# Altium schematic sheet ThrowBot_TX_Main_Board.SchDoc
size 247 x 208 mm; SheetNumber: 1; SheetTotal: 1
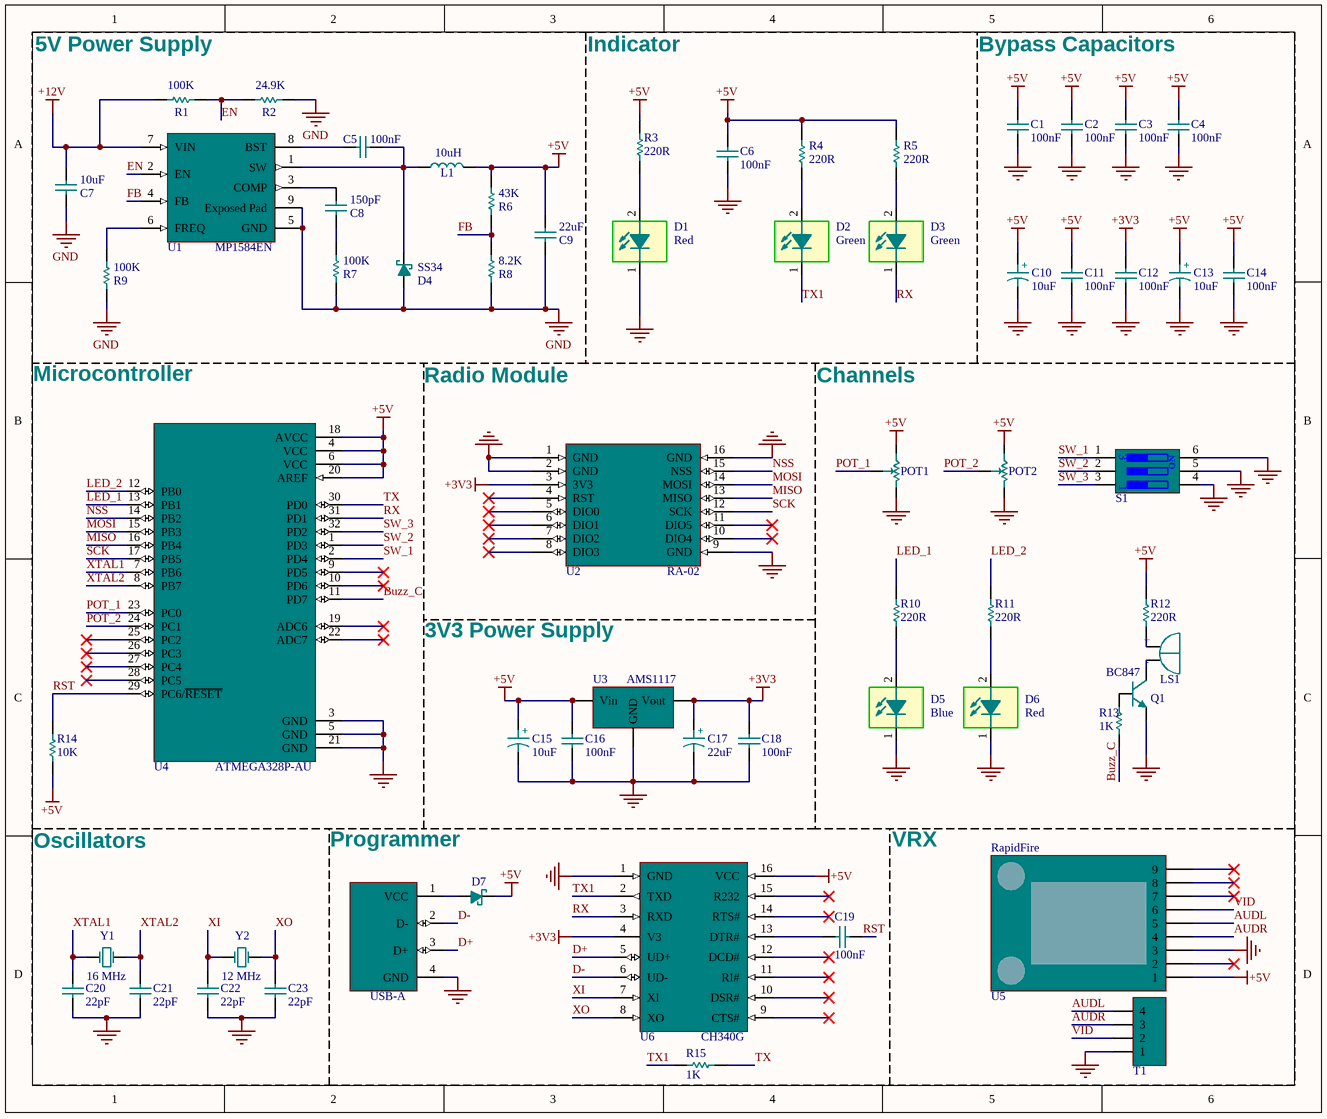
[diagram p0: ThrowBot_TX_Main_Board.SchDoc]

## Parts
C1  Val-1: 100nF  [CAP 1206]  (hidden comment: Cap)
C2  Val-1: 100nF  [CAP 1206]  (hidden comment: Cap)
C3  Val-1: 100nF  [CAP 1206]  (hidden comment: Cap)
C4  Val-1: 100nF  [CAP 1206]  (hidden comment: Cap)
C5  Val-1: 100nF  [CAP 1206]  (hidden comment: Cap)
C6  Val-1: 100nF  [CAP 1206]  (hidden comment: Cap)
C7  Val-4: 10uF  [CAP 1206]  (hidden comment: Cap)
C8  Val-5: 150pF  [CAP 1206]  (hidden comment: Cap)
C9  Val-3: 22uF  [CAP 1206]  (hidden comment: Cap)
C10  Val-1: 10uF  [CAP Tantalum Size B]  (hidden comment: Cap BiPolar)
C11  Val-1: 100nF  [CAP 1206]  (hidden comment: Cap)
C12  Val-1: 100nF  [CAP 1206]  (hidden comment: Cap)
C13  Val-1: 10uF  [CAP Tantalum Size B]  (hidden comment: Cap BiPolar)
C14  Val-1: 100nF  [CAP 1206]  (hidden comment: Cap)
C15  Val-1: 10uF  [CAP Tantalum Size B]  (hidden comment: Cap BiPolar)
C16  Val-1: 100nF  [CAP 1206]  (hidden comment: Cap)
C17  Val-1: 22uF  [CAP Tantalum Size B]  (hidden comment: Cap BiPolar)
C18  Val-1: 100nF  [CAP 1206]  (hidden comment: Cap)
C19  Val-1: 100nF  [CAP 1206]  (hidden comment: Cap)
C20  Val-2: 22pF  [CAP 1206]  (hidden comment: Cap)
C21  Val-2: 22pF  [CAP 1206]  (hidden comment: Cap)
C22  Val-2: 22pF  [CAP 1206]  (hidden comment: Cap)
C23  Val-2: 22pF  [CAP 1206]  (hidden comment: Cap)
D1  Color-2: Red  [LED 1206]  (hidden comment: LED)
D2  Color-3: Green  [LED 1206]  (hidden comment: LED)
D3  Color-3: Green  [LED 1206]  (hidden comment: LED)
D4  SS34  [SS34]
D5  Color-1: Blue  [LED 1206]  (hidden comment: LED)
D6  Color-2: Red  [LED 1206]  (hidden comment: LED)
D7  SS34  [SS34]  (value not drawn)
L1  value 10uH  [IND 10uH]  (hidden comment: Inductor)
LS1  Buzzer-5V  [Buzzer-5V]  (value not drawn)
POT1  Pot  [Pot]  (value not drawn)
POT2  Pot  [Pot]  (value not drawn)
Q1  BC847  [BC847-SOT23]
R1  Val-4: 100K  [RES 1206]  (hidden comment: Resistor)
R2  Val-5: 24.9K  [RES 1206]  (hidden comment: Resistor)
R3  Val-3: 220R  [RES 1206]  (hidden comment: Resistor)
R4  Val-3: 220R  [RES 1206]  (hidden comment: Resistor)
R5  Val-3: 220R  [RES 1206]  (hidden comment: Resistor)
R6  Val-7: 43K  [RES 1206]  (hidden comment: Resistor)
R7  Val-4: 100K  [RES 1206]  (hidden comment: Resistor)
R8  Val-6: 8.2K  [RES 1206]  (hidden comment: Resistor)
R9  Val-4: 100K  [RES 1206]  (hidden comment: Resistor)
R10  Val-3: 220R  [RES 1206]  (hidden comment: Resistor)
R11  Val-3: 220R  [RES 1206]  (hidden comment: Resistor)
R12  Val-3: 220R  [RES 1206]  (hidden comment: Resistor)
R13  Val-1: 1K  [RES 1206]  (hidden comment: Resistor)
R14  Val-2: 10K  [RES 1206]  (hidden comment: Resistor)
R15  Val-1: 1K  [RES 1206]  (hidden comment: Resistor)
S1  DIP Switch x3  [DIP Switch x3]  (value not drawn)
T1  4 Pin Socket  [XH-4AW]  (value not drawn)
U1  MP1584EN  [MP1584EN]
U2  RA-02  [RA-02]
U3  AMS1117  [AMS1117]
U4  ATMEGA328P-AU  [ATmega328]
U5  RapidFire  [RapidFire]
U6  CH340G  [CH340G]
USB1  USB-A  [USB-A-SMD]
Y1  Val-2: 16 MHz  [Crystal-5032]  (hidden comment: XTAL)
Y2  Val-1: 12 MHz  [Crystal-5032]  (hidden comment: XTAL)

## Blocks framed on the sheet
5V Power Supply: C5 C7-C9 D4 L1 R1 R2 R6-R9 U1

## Nets
+3V3: C12.1 C17.1 C18.1 U2.3(3V3) U3.2(Vout) U6.4(V3)
+5V: C1.1 C2.1 C3.1 C4.1 C6.1 C9.2 C10.1 C11.1 C13.1 C14.1 C15.1 C16.1 D7.2(K) L1.2 POT1.1(CCW) POT2.1(CCW) R3.2 R4.1 R5.1 R6.2 R12.2 R14.2 U3.3(Vin) U4.4(VCC) U4.6(VCC) U4.18(AVCC) U4.20(AREF) U5.1 U6.16(VCC)
+12V: C7.2 R1.2 U1.7(VIN)
GND: C1.2 C2.2 C3.2 C4.2 C6.2 C7.1 C9.1 C10.2 C11.2 C12.2 C13.2 C14.2 C15.2 C16.2 C17.2 C18.2 C20.1 C21.1 C22.1 C23.1 D1.1 D4.1(A) D5.1 D6.1 POT1.2(CW) POT2.2(CW) Q1.2(E) R2.2 R7.1 R8.1 R9.1 S1.4 S1.5 S1.6 T1.1 U1.5(GND) U1.9(Exposed_Pad) U2.1(GND) U2.2(GND) U2.9(GND) U2.16(GND) U3.1(GND) U4.3(GND) U4.5(GND) U4.21(GND) U5.3 U6.1(GND) USB1.4(GND)
AUDL: T1.4 U5.5
AUDR: T1.3 U5.4
Buzz_C: R13.1 U4.11(PD7)
D+: U6.5(UD+) USB1.3(D+)
D-: U6.6(UD-) USB1.2(D-)
EN: R1.1 R2.1 U1.2(EN)
FB: R6.1 R8.2 U1.4(FB)
LED_1: R10.2 U4.13(PB1)
LED_2: R11.2 U4.12(PB0)
MISO: U2.13(MISO) U4.16(PB4)
MOSI: U2.14(MOSI) U4.15(PB3)
NSS: U2.15(NSS) U4.14(PB2)
POT_1: POT1.3(SetPoint) U4.23(PC0)
POT_2: POT2.3(SetPoint) U4.24(PC1)
RST: C19.1 R14.1 U4.29(PC6/~{RESET})
RX: D3.1 U4.31(PD1) U6.3(RXD)
SCK: U2.12(SCK) U4.17(PB5)
SW_1: S1.1 U4.2(PD4)
SW_2: S1.2 U4.1(PD3)
SW_3: S1.3 U4.32(PD2)
TX: R15.2 U4.30(PD0)
TX1: D2.1 R15.1 U6.2(TXD)
VID: T1.2 U5.6
XI: C22.2 U6.7(XI) Y2.1(OSC1)
XO: C23.2 U6.8(XO) Y2.2(OSC2)
XTAL1: C20.2 U4.7(PB6) Y1.1(OSC1)
XTAL2: C21.2 U4.8(PB7) Y1.2(OSC2)
NetC5_1: C5.1 D4.2(K) L1.1 U1.1(SW)
NetC5_2: C5.2 U1.8(BST)
NetC8_1: C8.1 R7.2
NetC8_2: C8.2 U1.3(COMP)
NetC19_2: C19.2 U6.13(DTR#)
NetD1_2: D1.2 R3.1
NetD2_2: D2.2 R4.2
NetD3_2: D3.2 R5.2
NetD5_2: D5.2 R10.1
NetD6_2: D6.2 R11.1
NetD7_1: D7.1(A) USB1.1(VCC)
NetLS1_N: LS1.N(NEG) Q1.3(C)
NetLS1_P: LS1.P(POS) R12.1
NetQ1_1: Q1.1(B) R13.2
NetR9_2: R9.2 U1.6(FREQ)

Not connected (* = marked no-connect by the designer): U2 4(RST)* 5(DIO0)* 6(DIO1)* 7(DIO2)* 8(DIO3)* 10(DIO4)* 11(DIO5)*; U4 9(PD5)* 10(PD6)* 19(ADC6)* 22(ADC7)* 25(PC2)* 26(PC3)* 27(PC4)* 28(PC5)*; U5 2* 7* 8* 9*; U6 9(CTS#)* 10(DSR#)* 11(RI#)* 12(DCD#)* 14(RTS#)* 15(R232)*

## Notes on the sheet
- Indicator
- Bypass Capacitors
- Microcontroller
- Radio Module
- Channels
- 3V3 Power Supply
- Oscillators
- Programmer
- VRX
- (in symbol Buzzer-5V) +; -
- (in symbol Cap BiPolar) +
- (in symbol DIP Switch x3) ON

## Library data of the parts
C1 = Cap: AVCC Cap; Val-2: 22pF; Val-3: 22uF
C2 C3 = Cap: VCC Cap; Val-2: 22pF; Val-3: 22uF
C4 = Cap: AREF Cap; Val-2: 22pF; Val-3: 22uF
C5 = Cap: 1206 Capacitor; Val-2: 22pF; Val-3: 22uF; Val-4: 10uF50V
C6 C11 C12 = Cap: USB to TTL Cap; Val-2: 22pF; Val-3: 22uF
C7 = Cap: 1206 Capacitor; Val-1: 100nF; Val-2: 22pF; Val-3: 22uF; Val-5: 150pF
C8 = Cap: 1206 Capacitor; Val-1: 100nF; Val-2: 22pF; Val-3: 22uF; Val-4: 10uF
C9 = Cap: 1206 Capacitor; Val-1: 100nF; Val-2: 22pF; Val-4: 10uF; Val-5: 150pF
C10 = Cap BiPolar: USB to TTL Cap; Val-2: 100uF; Val-3: 1000uF
C13 = Cap BiPolar: RapidFire Cap; Val-2: 100uF; Val-3: 1000uF
C14 = Cap: RapidFire Cap; Val-2: 22pF; Val-3: 22uF
C15 C17 = Cap BiPolar: 3.3V Regulator Cap; Val-2: 100uF; Val-3: 1000uF
C16 C18 = Cap: 3.3V Regulator Cap; Val-2: 22pF; Val-3: 22uF
C19 = Cap: Programmer Cap; Val-2: 22pF; Val-3: 22uF
C20-C23 = Cap: 1206 Capacitor; Val-1: 100nF; Val-3: 22uF
D1 D6 = LED: Color-1: Blue; Color-3: Green; Color-4: White
D2 D3 = LED: Color-1: Blue; Color-2: Red; Color-4: White
D4 = SS34: Diode Schottky 40 V 3A Surface Mount SMA; MF: MDD; SnapEDA_Link: https://www.snapeda.com/parts/SS34/MDD/view-part/?ref=snap; Package: None; Value: *; MP: SS34; Check_prices: https://www.snapeda.com/parts/SS34/MDD/view-part/?ref=eda
D5 = LED: Color-2: Red; Color-3: Green; Color-4: White
D7 = SS34: Diode Schottky 40 V 3A Surface Mount SMA
L1 = Inductor: Code_IEC: 1005; Published: 8-Jun-2000; LatestRevisionDate: 29-May-2009; LatestRevisionNote: IPC-7351 Footprint Added.; PackageReference: 0402-A; Publisher: Altium Limited; PackageDescription: Chip Inductor; Code_JEITA: 0402
Q1 = BC847: NPN General-purpose Transistor; Designer: Abbas Basereh; Desc.: Plastic Medium-Power. Silicon NPN Transistors; Data: 27-12-2016
R1 R7 R9 = Resistor: Val-1: 1K; Val-2: 10K; Val-3: 220R; Val-5: 24.9K; Val-6: 8.2K; Val-7: 43K
R2 = Resistor: Val-1: 1K; Val-2: 10K; Val-3: 220R; Val-4: 100K; Val-6: 8.2K; Val-7: 43K
R3 R10 R11 = Resistor: Val-1: 1K; Val-2: 10K
R4 R5 R12 = Resistor: Val-1: 1K; Val-2: 10K; Val-4: 100K; Val-5: 24.9K; Val-6: 8.2K; Val-7: 43K; Val-8: 150R; Val-9: 100m; Val-10: 6K; Val-11: 4K; Val-12: 1.2K
R6 = Resistor: Val-1: 1K; Val-2: 10K; Val-3: 220R; Val-4: 100K; Val-5: 24.9K; Val-6: 8.2K
R8 = Resistor: Val-1: 1K; Val-2: 10K; Val-3: 220R; Val-4: 100K; Val-5: 24.9K; Val-7: 43K
R13 R15 = Resistor: Val-2: 10K; Val-3: 220R; Val-4: 100K; Val-5: 24.9K; Val-6: 8.2K; Val-7: 43K; Val-8: 150R; Val-9: 100m; Val-10: 6K; Val-11: 4K; Val-12: 1.2K
R14 = Resistor: Val-1: 1K; Val-3: 220R
U1 = MP1584EN: Buck Switching Regulator IC Positive Adjustable 0.8V 1 Output 3A 8-SOIC (0.154, 3.90mm Width) Exposed Pad; MF: Monolithic Power; Value: *; SnapEDA_Link: https://www.snapeda.com/parts/MP1584EN/Monolithic+Power+Systems+Inc./view-part/?ref=snap; MP: MP1584EN; Purchase-URL: https://pricing.snapeda.com/search/part/MP1584EN/?ref=eda; Check_prices: https://www.snapeda.com/parts/MP1584EN/Monolithic+Power+Systems+Inc./view-part/?ref=eda; Availability: In Stock; Price: None; Package: SOIC-8 Monolithic Power
U2 = RA-02: LoRa RA-02
U3 = AMS1117: 3V3 Regulator
U4 = ATMEGA328P-AU: ATmega 328 Microcontroller
Y1 = XTAL: XTAL Crystal; Val-1: 12 MHz
Y2 = XTAL: XTAL Crystal; Val-2: 16 MHz